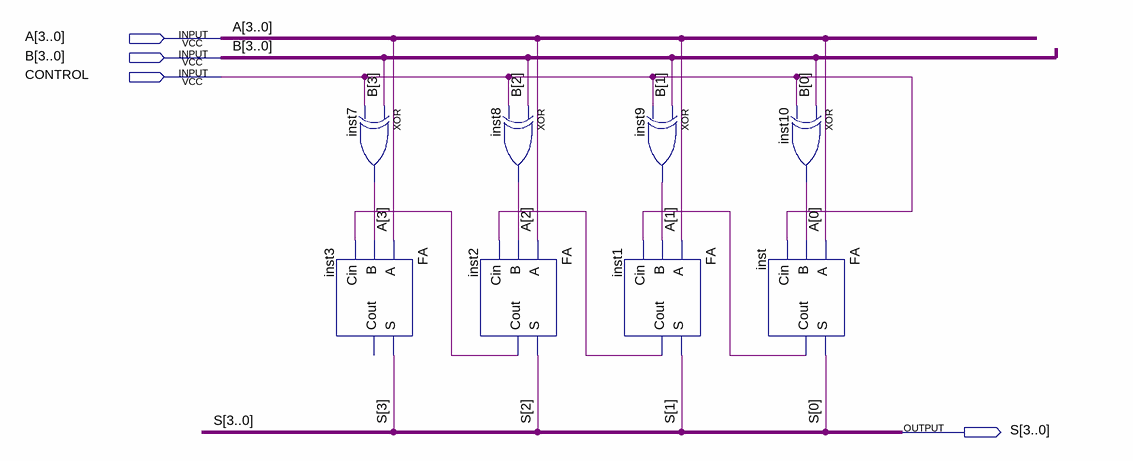
[diagram p0: schematic sheet]
// Quartus schematic CONGTRU4BIT.bdf as structural Verilog: 8 symbols, 4 pins
module CONGTRU4BIT (
  input  [3:0] A,
  input  [3:0] B,
  input  CONTROL,
  output [3:0] S
);

  wire inst1_cout, inst2_cout, inst7_out, inst8_out, inst9_out, inst10_out, inst_cout;

  xor inst7 (inst7_out, B[3], CONTROL);
  FA inst3 (.A(A[3]), .B(inst7_out), .Cin(inst2_cout), .S(S[3]));  // open: Cout
  xor inst8 (inst8_out, B[2], CONTROL);
  FA inst2 (.A(A[2]), .B(inst8_out), .Cin(inst1_cout), .S(S[2]), .Cout(inst2_cout));
  xor inst9 (inst9_out, B[1], CONTROL);
  FA inst1 (.A(A[1]), .B(inst9_out), .Cin(inst_cout), .S(S[1]), .Cout(inst1_cout));
  xor inst10 (inst10_out, B[0], CONTROL);
  FA inst (.A(A[0]), .B(inst10_out), .Cin(CONTROL), .S(S[0]), .Cout(inst_cout));
endmodule
